# Altium project ESP32-SIM800C.PrjPCB (part 2 of 2)

## Sheet 05-USB-UART.SchDoc: *USBTOUART
size A4; SheetNumber: 6; SheetTotal: 7
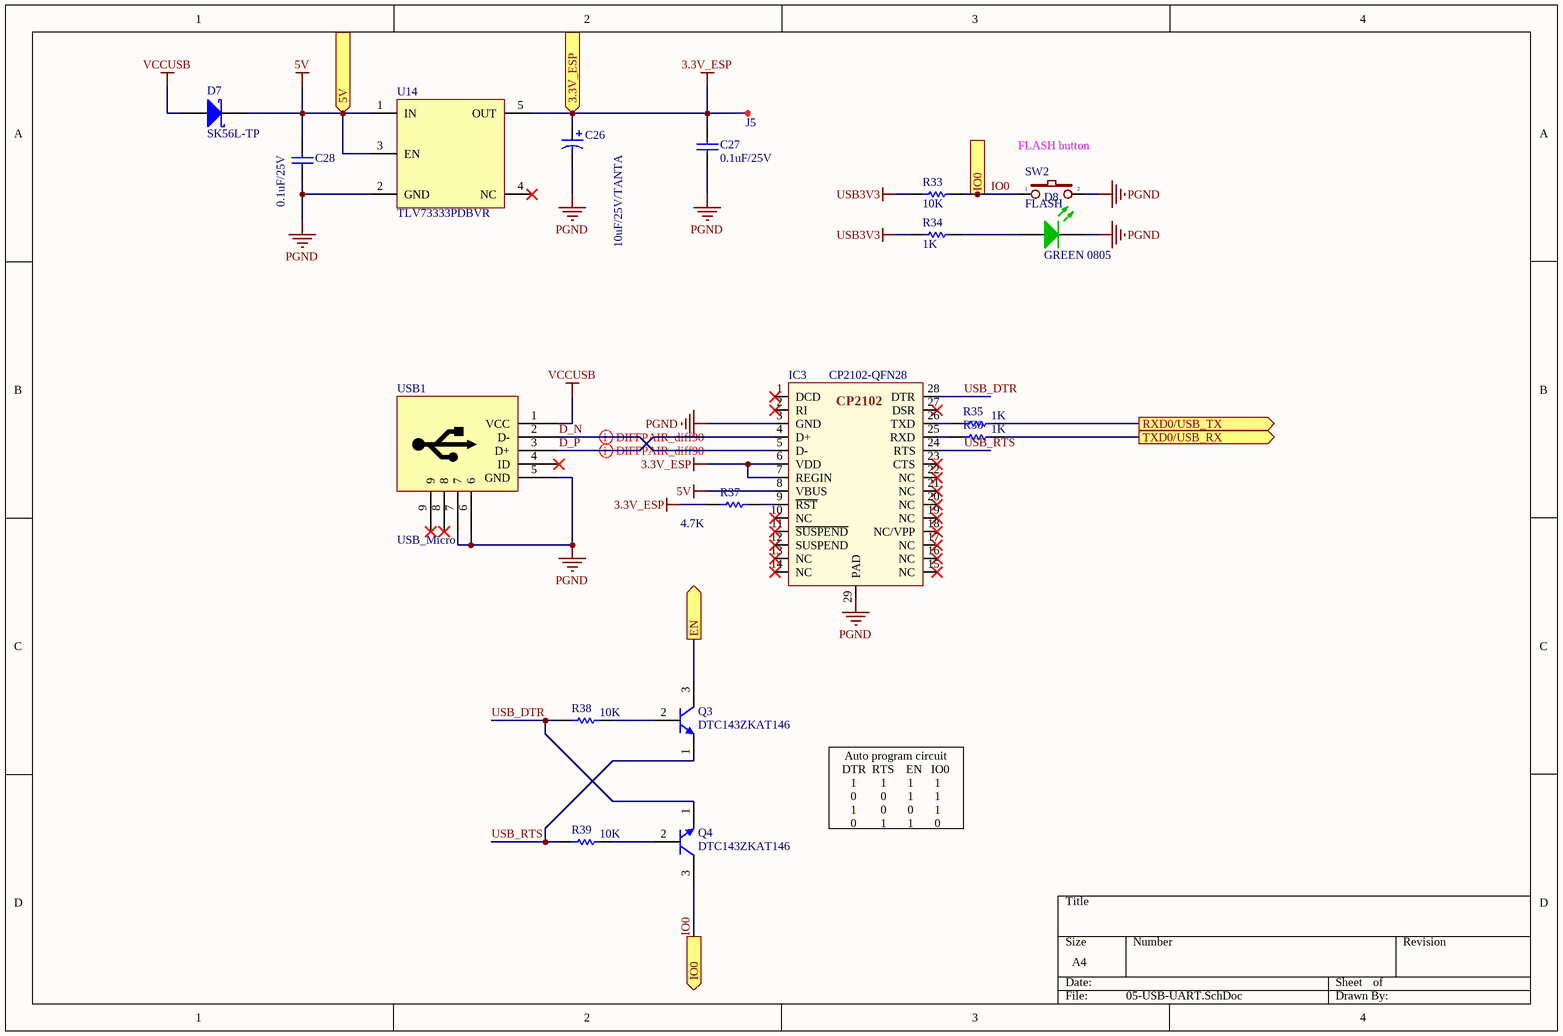
[diagram p6: 05-USB-UART.SchDoc]

### Parts
C26  10uF/25V/TANTA  [CAP TANT CASE B SMD]
C27  0.1uF/25V  [CAP_CERA_C2012(CC0805INCH)]
C28  0.1uF/25V  [CAP_CERA_C2012(CC0805INCH)]
D7  SK56L-TP  [30# SK56L-TPMSCT-ND]
D8  GREEN 0805  [Led 0805G]
IC3  CP2102-QFN28  [CP2102-QFN28]
J5  TEST POINT  [TEST POINT 1mm]  (value not drawn)
Q3  DTC143ZKAT146  [6# DTC143ZKAT146-E]
Q4  DTC143ZKAT146  [6# DTC143ZKAT146-E]
R33  10K  [Res 0805 SMD]
R34  1K  [Res 0805 SMD]
R35  1K  [Res 0805 SMD]
R36  1K  [Res 0805 SMD]
R37  4.7K  [Res 0805 SMD]
R38  10K  [Res 0805 SMD]
R39  10K  [Res 0805 SMD]
SW2  FLASH  [Button 3x4mm]
U14  TLV73333PDBVR  [20# TLV73333PDBVR]
USB1  USB_Micro  [USB_MICRO_B - Digikey]

### Ports
3.3V_ESP (in), 5V (in), EN (out), IO0 (out), RXD0/USB_TX (out), TXD0/USB_RX (out)

### Nets
3.3V_ESP: C26.1 C27.2 IC3.6(VDD) IC3.7(REGIN) J5.1(TP) R37.1 U14.5(OUT) ; port 3.3V_ESP
5V: C28.2 D7.2(K) IC3.8(VBUS) U14.1(IN) U14.3(EN) ; port 5V
PGND: C26.2 C27.1 C28.1 D8.2(K) IC3.3(GND) IC3.29(PAD) SW2.2 U14.2(GND) USB1.5(GND) USB1.6 USB1.7
USB3V3: R33.1 R34.1
VCCUSB: D7.1(A) USB1.1(VCC)
D_N: IC3.5(D-) USB1.2(D-)
D_P: IC3.4(D+) USB1.3(D+)
EN: Q3.3(C) ; port EN
IO0: Q4.3(C) R33.2 SW2.1 ; port IO0
USB_DTR: IC3.28(DTR) Q4.1(E) R38.2
USB_RTS: IC3.24(RTS) Q3.1(E) R39.2
NetD8_1: D8.1(A) R34.2
NetIC3_9: IC3.9(~{RST}) R37.2
NetIC3_25: IC3.25(RXD) R36.2
NetIC3_26: IC3.26(TXD) R35.2
NetQ3_2: Q3.2(B) R38.1
NetQ4_2: Q4.2(B) R39.1
NetR35_1: R35.1 ; port RXD0/USB_TX
NetR36_1: R36.1 ; port TXD0/USB_RX

Not connected (* = marked no-connect by the designer): IC3 1(DCD)* 2(RI)* 10(NC)* 11(~{SUSPEND})* 12(SUSPEND)* 13(NC)* 14(NC)* 15(NC)* 16(NC)* 17(NC)* 18(NC/VPP)* 19(NC)* 20(NC)* 21(NC)* 22(NC)* 23(CTS)* 27(DSR)*; U14 4(NC)*; USB1 4(ID)* 8* 9*

### Layout directives
differential pair; differential pair class diff90: D_N, D_P

### Notes on the sheet
- (near SW2) FLASH button
- Auto program circuit
  DTR  RTS    EN   IO0
  1        1       1       1
  0        0       1       1
  1        0       0       1
  0        1       1       0
- Title
- Size:
- Date:
- A3
- Number:
- Time:
- Revision:
- Sheet
- of
- File:

### Library data of the parts
C26 = TAJB106M025RNJ: 10µF Molded Tantalum Capacitors 25V 1411 (3528 Metric) 3 Ohm; Manufacturer: KEMET; Digikey: 399-5125-1-ND
C27 = 0.1uF/50V/C0603/10%: 0.1µF ±10% 25V Ceramic Capacitor X7R 0805 (2012 Metric); Manufacturer: KEMET; ComponentLink1URL: http://www.murata.com/~/media/webrenewal/support/library/catalog/products/capacitor/mlcc/c02e.ashx; ComponentLink1Description: http://www.murata.com/~/media/webrenewal/support/library/catalog/products/capacitor/mlcc/c02e.ashx; Digikey: 478-3755-1-ND
C28 = 0.1uF/50V/C0603/10%: as C22 on sheet 02-ESP32; ComponentLink1URL: http://www.murata.com/~/media/webrenewal/support/library/catalog/products/capacitor/mlcc/c02e.ashx; ComponentLink1Description: http://www.murata.com/~/media/webrenewal/support/library/catalog/products/capacitor/mlcc/c02e.ashx; Digikey: 478-3755-1-ND
D7 = 30# SK56L-TP: DIODE SCHOTTKY 60V 5A DO214AB; ComponentLink1URL: http://www.mccsemi.com/up_pdf/SK52L-SK510L(DO-214AB).PDF; ComponentLink1Description: http://www.mccsemi.com/up_pdf/SK52L-SK510L(DO-214AB).PDF; Digikey: SK56L-TPMSCT-ND
D8 = LED GREEN 0603: Green 571nm LED Indication - Discrete 2V 0805 (2012 Metric); ComponentLink1URL: http://optoelectronics.liteon.com/upload/download/DS22-2000-074/S_110_LTST-C190KGKT.pdf; ComponentLink1Description: http://optoelectronics.liteon.com/upload/download/DS22-2000-074/S_110_LTST-C190KGKT.pdf; Digikey: 160-1426-1-ND
IC3 = CP2102: USB Bridge, USB to UART USB 2.0 UART Interface 28-QFN (5x5); Digikey: 336-3694-ND; VNBuy: https://banlinhkien.vn/goods-2607-cp2102-qfn28.html
J5 = PAD 1mm: TPoint
Q3 Q4 = 6#DTC143ZKAT146: Pre-Biased Bipolar Transistor (BJT) NPN - Pre-Biased 50V 100mA 250MHz 200mW Surface Mount SMT3; Digikey: DTC143ZKAT146CT-ND
R33 = 200K/R0603/1%: 10 kOhms ±1% 0.125W, 1/8W Chip Resistor 0805 (2012 Metric) Thick Film; Power (Watts): 0.1W, 1/10W; RoHS: RoHS Compliant; Category: Resistors; Part Status: Active; Features: Moisture Resistant; Operating Temperature: -55°C ~ 155°C; Package / Case: 0603 (1608 Metric); Supplier Device Package: 0603; Size / Dimension: 0.063" L x 0.031" W (1.60mm x 0.80mm); Height - Seated (Max): 0.022" (0.55mm); Failure Rate: -; ComponentLink1URL: http://www.yageo.com/documents/recent/PYu-RC_Group_51_RoHS_L_7.pdf; ComponentLink1Description: http://www.yageo.com/documents/recent/PYu-RC_Group_51_RoHS_L_7.pdf; Digikey: A126332CT-ND
R34 = 200K/R0603/1%: 1 kOhms ±1% 0.125W, 1/8W Chip Resistor 0805 (2012 Metric) Automotive AEC-Q200 Thick Film; Power (Watts): 0.1W, 1/10W; RoHS: RoHS Compliant; Category: Resistors; Part Status: Active; Features: Moisture Resistant; Operating Temperature: -55°C ~ 155°C; Package / Case: 0603 (1608 Metric); Supplier Device Package: 0603; Size / Dimension: 0.063" L x 0.031" W (1.60mm x 0.80mm); Height - Seated (Max): 0.022" (0.55mm); Failure Rate: -; ComponentLink1URL: http://www.yageo.com/documents/recent/PYu-RC_Group_51_RoHS_L_7.pdf; ComponentLink1Description: http://www.yageo.com/documents/recent/PYu-RC_Group_51_RoHS_L_7.pdf; Digikey: 541-1.00KCCT-ND
R35 R36 = 34.8K/R0805/1%: 1 kOhms ±1% 0.125W, 1/8W Chip Resistor 0805 (2012 Metric) Automotive AEC-Q200 Thick Film; Power Rating: 100mW; Resistance: 34.8kR; Voltage Rating: 50V; Case/Package: 0603; Case Code (Imperial): 0603; Case Code (Metric): 1608; Min Operating Temperature: -55°C; Max Operating Temperature: 155°C; Termination: SMD/SMT; Military Standard: Not; Voltage Rating (DC): 50V; Length: 1.6mm; Height: 0.45mm; Width: 0.8mm; Depth: 0.8mm; Lead Free: Lead Free; Digikey: 541-1.00KCCT-ND
R37 = 34.8K/R0805/1%: 4.7 kOhms ±1% 0.125W, 1/8W Chip Resistor 0805 (2012 Metric) Thick Film; Digikey: 541-4131-1-ND
R38 R39 = 34.8K/R0805/1%: 10 kOhms ±1% 0.125W, 1/8W Chip Resistor 0805 (2012 Metric) Thick Film; Power Rating: 100mW; Resistance: 34.8kR; Voltage Rating: 50V; Case/Package: 0603; Case Code (Imperial): 0603; Case Code (Metric): 1608; Min Operating Temperature: -55°C; Max Operating Temperature: 155°C; Termination: SMD/SMT; Military Standard: Not; Voltage Rating (DC): 50V; Length: 1.6mm; Height: 0.45mm; Width: 0.8mm; Depth: 0.8mm; Lead Free: Lead Free; Digikey: A126332CT-ND
SW2 = SW2: SWITCH TACTILE SPST-NO 0.05A 12V; Digikey: CKN10384CT-ND
U14 = 20#TLV73333PDBVR: Linear Voltage Regulator IC Positive Fixed 1 Output 3.3V 300mA SOT-23-5; Digikey: 296-40673-1-ND
USB1 = USB_MINI: USB - micro B USB 2.0 Receptacle Connector 5 Position Surface Mount, Right Angle; Through Hole; BuyVN: https://banlinhkien.vn/goods-5145-microusb-mk5p-dip.html; Digikey: 609-4618-1-ND

## Nets that join several sheets
3.3V_ESP: 03-INPUT (5 pins), 02-ESP32 (C21.2 C22.2 R13.1 U5.2), 01-POWER (8 pins), 04-OUTPUT (5 pins), 05-USB-UART (7 pins)
4.4V: 01-POWER (11 pins), 06-SIM800C (6 pins)
5V: 01-POWER (5 pins), 04-OUTPUT (9 pins), 05-USB-UART (5 pins)
12V: 03-INPUT (8 pins), 01-POWER (7 pins)
DGND: Sheet1 (L4.1), 02-ESP32 (9 pins)
PGND: Sheet1 (L4.2 L5.2), 03-INPUT (9 pins), 01-POWER (34 pins), 04-OUTPUT (8 pins), 05-USB-UART (11 pins)
SGND: Sheet1 (L5.1), 06-SIM800C (24 pins)
EN: 02-ESP32 (C23.2 R13.2 R14.2 U5.3), 05-USB-UART (Q3.3)
IO0: 02-ESP32 (U5.25), 05-USB-UART (Q4.3 R33.2 SW2.1)
NetR19_2: 03-INPUT (R19.2 U6.3), 02-ESP32 (U5.10)
NetR20_2: 03-INPUT (R20.2 U7.3), 02-ESP32 (U5.11)
NetR24_1: 03-INPUT (R24.1 R25.2 R26.2), 02-ESP32 (U5.12)
NetR27_2: 03-INPUT (R27.2 U8.3), 02-ESP32 (U5.4)
NetR35_1: 02-ESP32 (U5.34), 05-USB-UART (R35.1)
NetR36_1: 02-ESP32 (U5.35), 05-USB-UART (R36.1)
NetU5_13: 02-ESP32 (U5.13), 04-OUTPUT (U9.2)
NetU5_14: 02-ESP32 (U5.14), 04-OUTPUT (U11.2)
NetU5_16: 02-ESP32 (U5.16), 04-OUTPUT (U13.2)
NetU5_23: 02-ESP32 (U5.23), 04-OUTPUT (U12.2)
NetU5_24: 02-ESP32 (U5.24), 04-OUTPUT (U10.2)
SIM_RX: 02-ESP32 (U5.28), 06-SIM800C (GSM1.2 IC4.2)
SIM_TX: 02-ESP32 (U5.27), 06-SIM800C (GSM1.1 IC4.1)

## Assembly variants
Variant of ESP32-SIM800C: all parts fitted